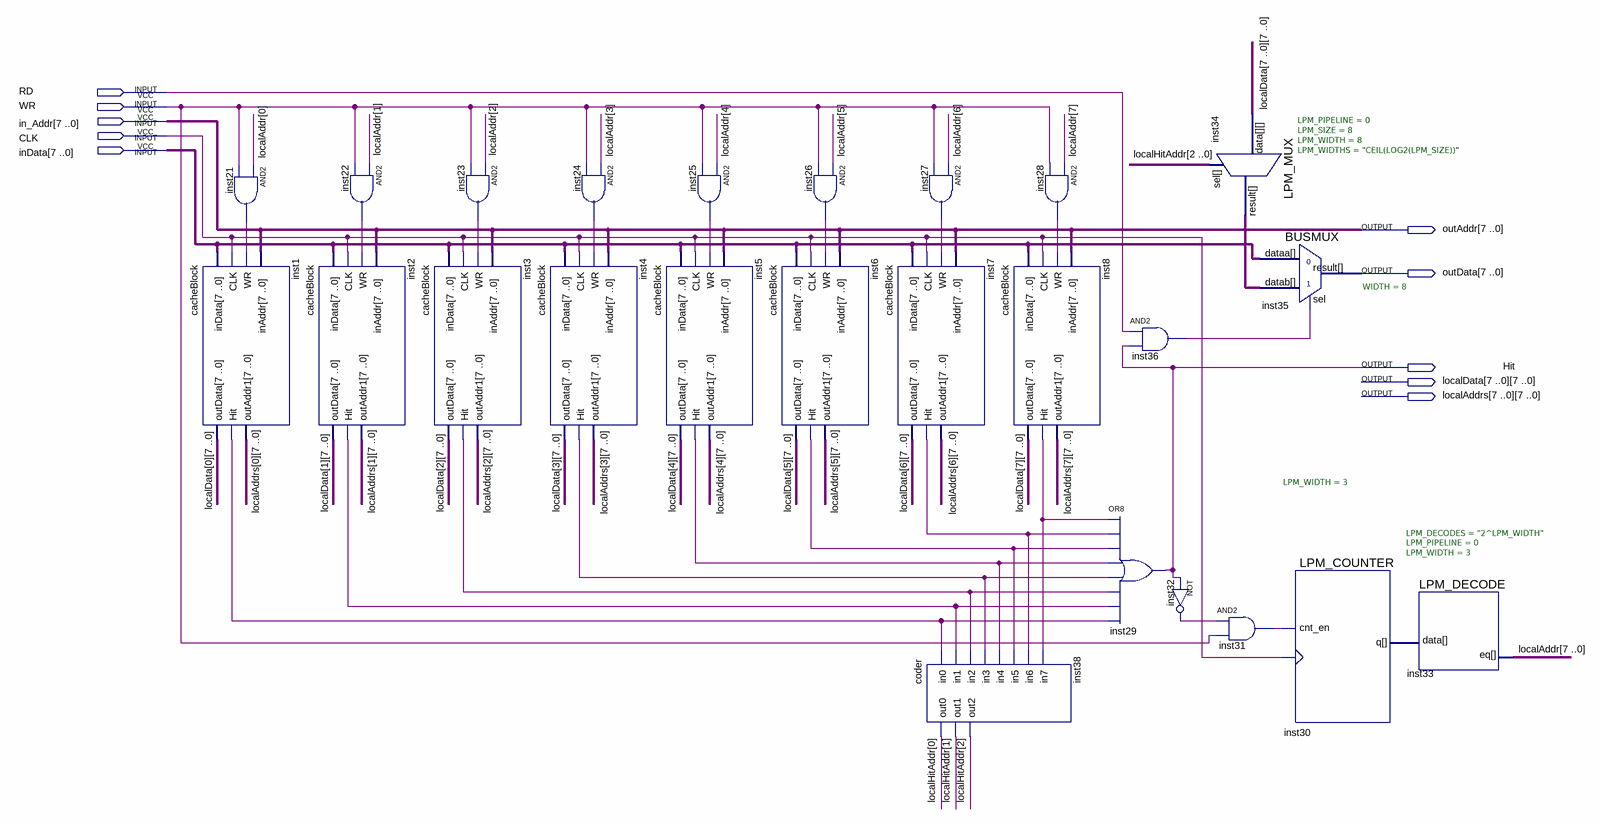
[diagram p0: schematic sheet]
// Quartus schematic cache.bdf as structural Verilog: 25 symbols, 10 pins
module cache (
  input  RD,
  input  WR,
  input  [7:0] in_Addr,
  input  CLK,
  input  [7:0] inData,
  output [7:0] outAddr,
  output [7:0] outData,
  output Hit,
  output [7:0] localData_7,
  output [7:0] localData_6,
  output [7:0] localData_5,
  output [7:0] localData_4,
  output [7:0] localData_3,
  output [7:0] localData_2,
  output [7:0] localData_1,
  output [7:0] localData_0,
  output [7:0] localAddrs_7,
  output [7:0] localAddrs_6,
  output [7:0] localAddrs_5,
  output [7:0] localAddrs_4,
  output [7:0] localAddrs_3,
  output [7:0] localAddrs_2,
  output [7:0] localAddrs_1,
  output [7:0] localAddrs_0
);

  wire inst1_hit, inst2_hit, inst3_hit, inst4_hit, inst5_hit, inst6_hit, inst7_hit, inst8_hit, inst21_out,
       inst22_out, inst23_out, inst24_out, inst25_out, inst26_out, inst27_out, inst28_out, inst31_out,
       inst32_out, inst36_out;
  wire [2:0] inst30_q, localHitAddr;
  wire [7:0] inst34_result, localAddr;

  and inst21 (inst21_out, localAddr[0], WR);
  cacheBlock inst1 (
    .inData(inData), .CLK(CLK), .WR(inst21_out), .inAddr(in_Addr), .outData(localData_0), .Hit(inst1_hit),
    .outAddr1(localAddrs_0));
  and inst22 (inst22_out, localAddr[1], WR);
  cacheBlock inst2 (
    .inData(inData), .CLK(CLK), .WR(inst22_out), .inAddr(in_Addr), .outData(localData_1), .Hit(inst2_hit),
    .outAddr1(localAddrs_1));
  and inst23 (inst23_out, localAddr[2], WR);
  cacheBlock inst3 (
    .inData(inData), .CLK(CLK), .WR(inst23_out), .inAddr(in_Addr), .outData(localData_2), .Hit(inst3_hit),
    .outAddr1(localAddrs_2));
  and inst24 (inst24_out, localAddr[3], WR);
  cacheBlock inst4 (
    .inData(inData), .CLK(CLK), .WR(inst24_out), .inAddr(in_Addr), .outData(localData_3), .Hit(inst4_hit),
    .outAddr1(localAddrs_3));
  and inst25 (inst25_out, localAddr[4], WR);
  cacheBlock inst5 (
    .inData(inData), .CLK(CLK), .WR(inst25_out), .inAddr(in_Addr), .outData(localData_4), .Hit(inst5_hit),
    .outAddr1(localAddrs_4));
  and inst26 (inst26_out, localAddr[5], WR);
  cacheBlock inst6 (
    .inData(inData), .CLK(CLK), .WR(inst26_out), .inAddr(in_Addr), .outData(localData_5), .Hit(inst6_hit),
    .outAddr1(localAddrs_5));
  and inst27 (inst27_out, localAddr[6], WR);
  cacheBlock inst7 (
    .inData(inData), .CLK(CLK), .WR(inst27_out), .inAddr(in_Addr), .outData(localData_6), .Hit(inst7_hit),
    .outAddr1(localAddrs_6));
  coder inst38 (
    .in0(inst1_hit), .in1(inst2_hit), .in2(inst3_hit), .in3(inst4_hit), .in4(inst5_hit), .in5(inst6_hit),
    .in6(inst7_hit), .in7(inst8_hit), .out0(localHitAddr[0]), .out1(localHitAddr[1]), .out2(localHitAddr[2]));
  and inst28 (inst28_out, localAddr[7], WR);
  cacheBlock inst8 (
    .inData(inData), .CLK(CLK), .WR(inst28_out), .inAddr(in_Addr), .outData(localData_7), .Hit(inst8_hit),
    .outAddr1(localAddrs_7));
  and inst36 (inst36_out, RD, Hit);
  or inst29 (Hit, inst8_hit, inst7_hit, inst6_hit, inst5_hit, inst4_hit, inst3_hit, inst2_hit, inst1_hit);
  LPM_MUX #(.LPM_PIPELINE(0), .LPM_SIZE(8), .LPM_WIDTH(8), .LPM_WIDTHS("CEIL(LOG2(LPM_SIZE))")) inst34 (
    .data({localData_7, localData_6, localData_5, localData_4, localData_3, localData_2, localData_1, localData_0}),
    .sel(localHitAddr), .result(inst34_result));
  not inst32 (inst32_out, Hit);
  and inst31 (inst31_out, inst32_out, WR);
  BUSMUX #(.WIDTH(8)) inst35 (.datab(inst34_result), .sel(inst36_out), .dataa(inData), .result(outData));
  LPM_COUNTER #(.LPM_WIDTH(3)) inst30 (.cnt_en(inst31_out), .clock(CLK), .q(inst30_q));
  LPM_DECODE #(.LPM_DECODES("2^LPM_WIDTH"), .LPM_PIPELINE(0), .LPM_WIDTH(3)) inst33 (.data(inst30_q), .eq(localAddr));

  assign outAddr = in_Addr;
endmodule
